# EasyEDA schematic ESP8266 Blind Board V2.json
TITLE: Sheet_1; REV: 1.0; Date: 2019-06-16; Sheet: 1/1; Drawn By: m4ha7m4; Company: Your Company
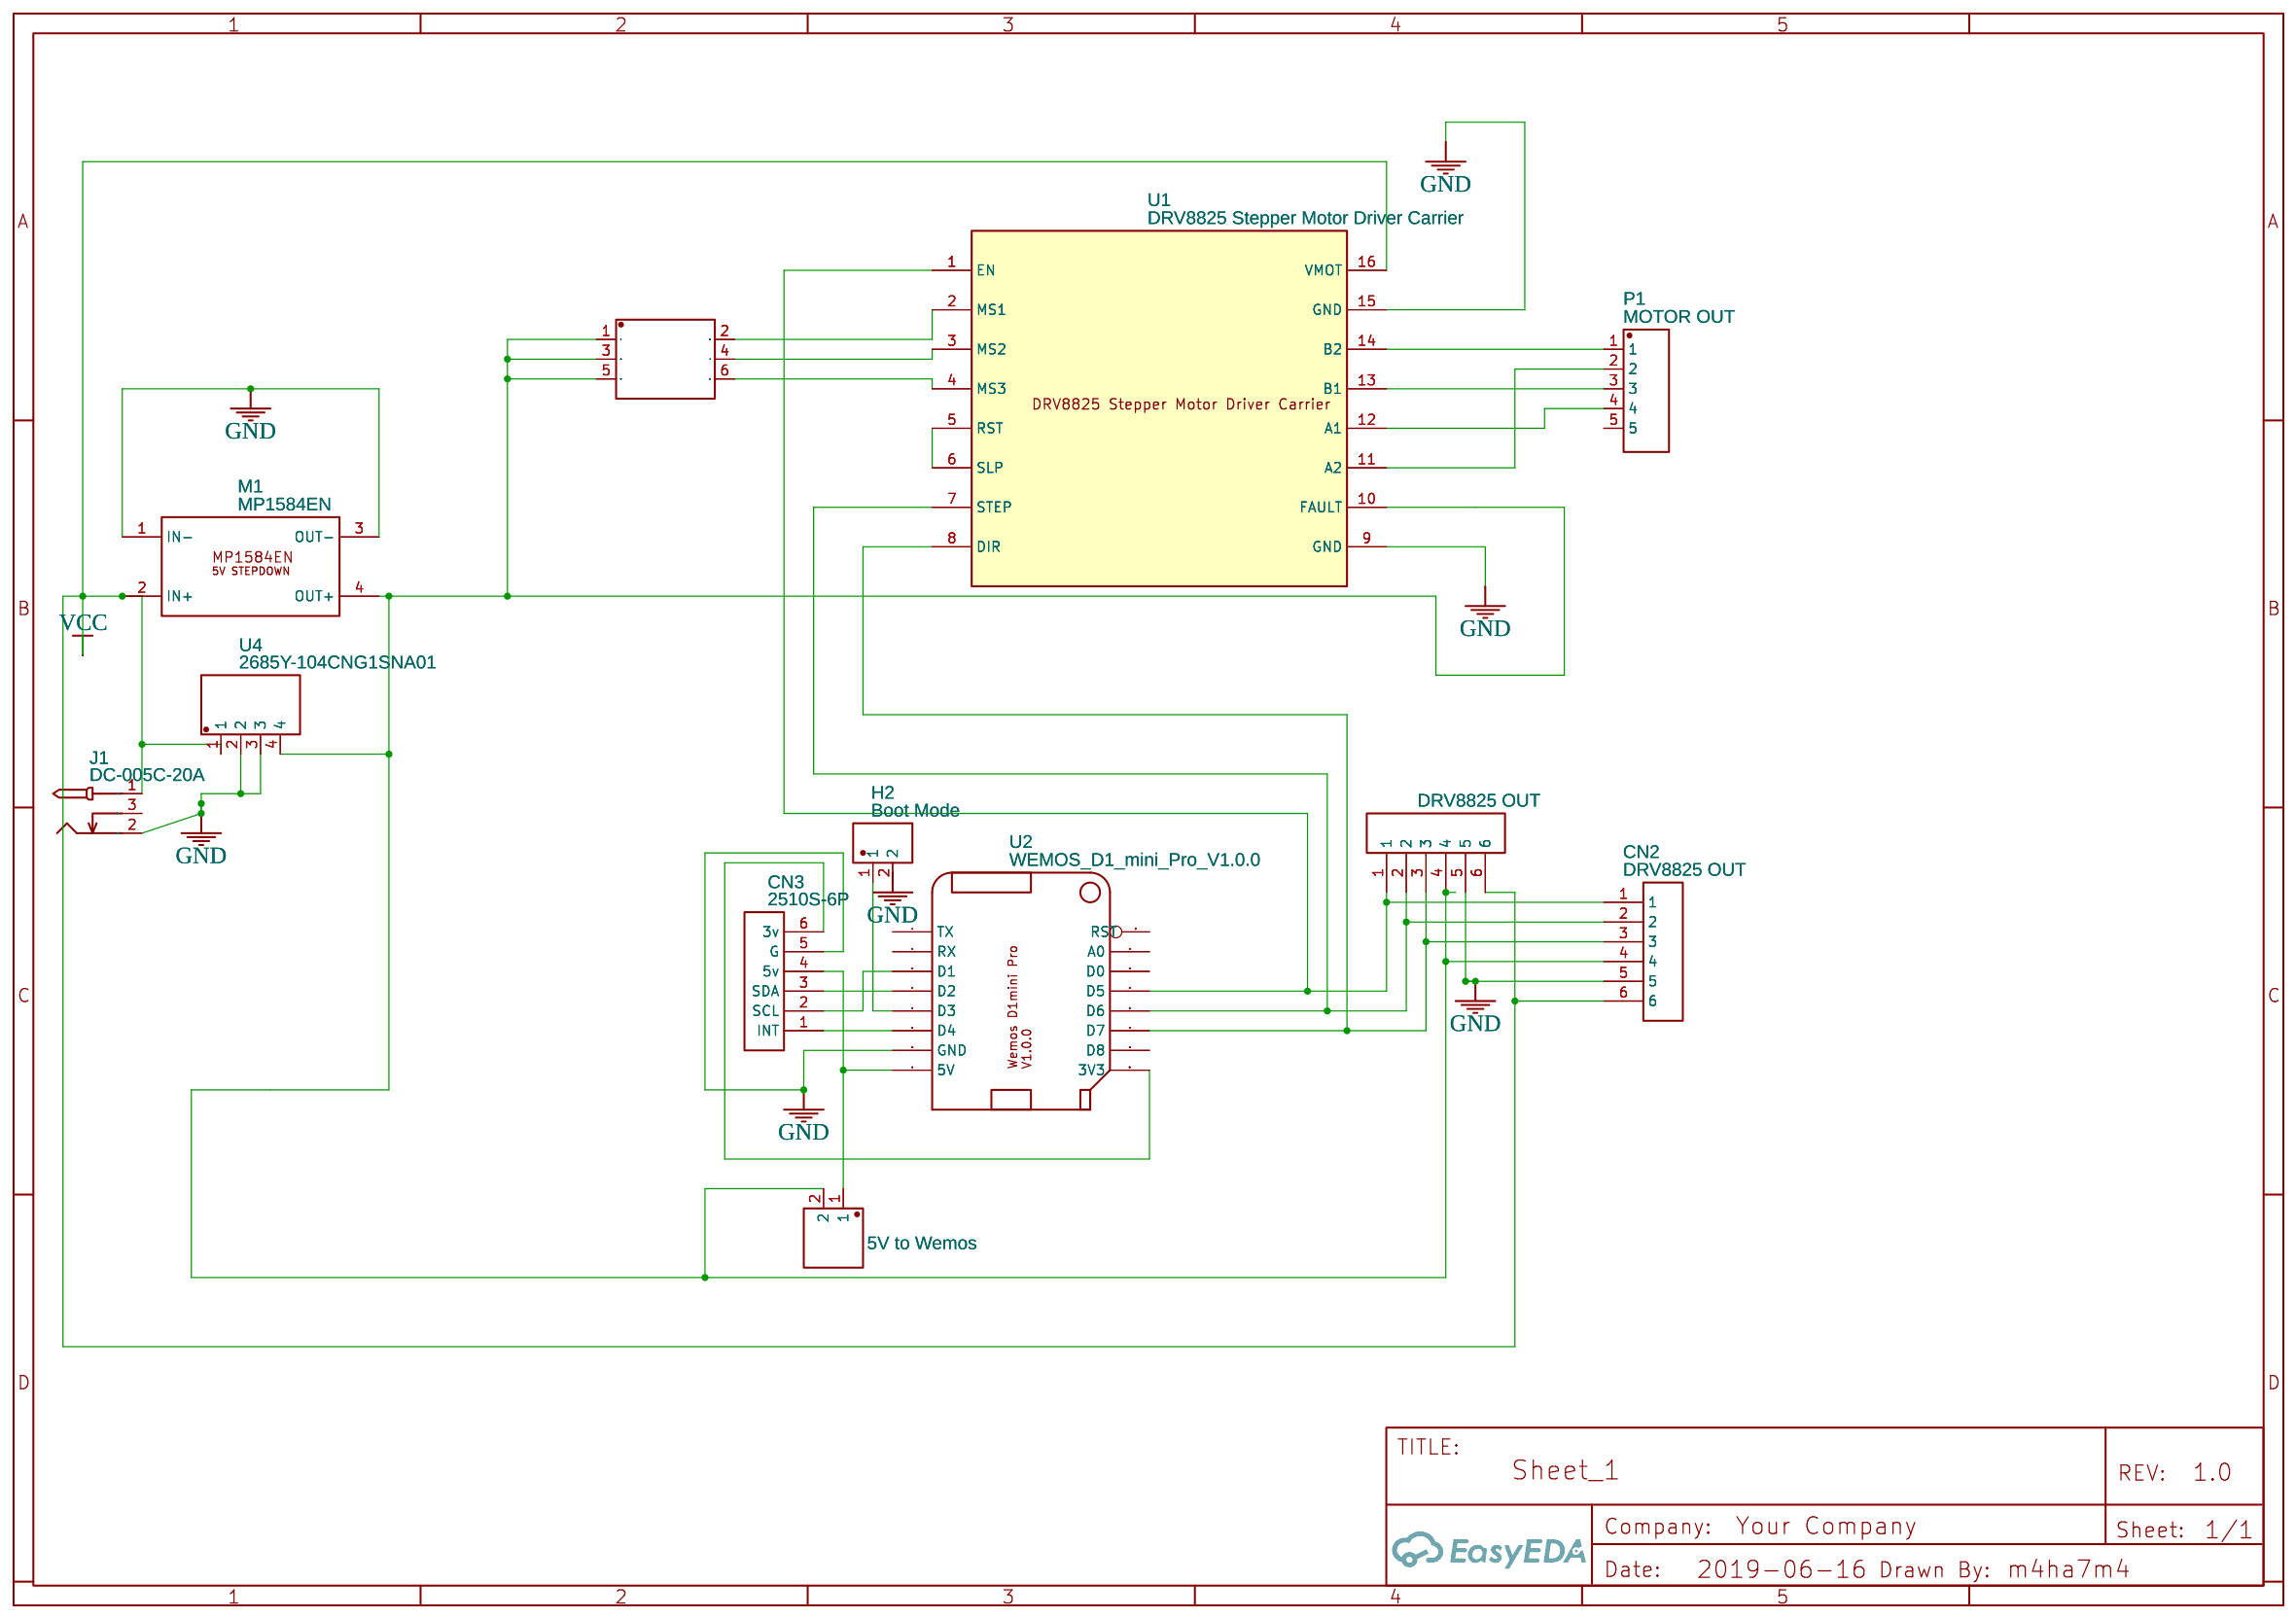
[diagram p0: schematic sheet]

## Parts
CN1  DRV8825 OUT  [SIP-2.54MM-6P-BOOMELE-H11.5]
CN2  DRV8825 OUT  [SIP-2.54MM-6P-BOOMELE-H11.5]
CN3  2510S-6P  [SIP-2.54MM-6P-BOOMELE-H11.5]
H1  5V to Wemos  [210S-1X2P]
H2  Boot Mode  [HDR-2X1/2.54]
J1  DC-005C-20A  [CON-TH_3PIN_DC-005C-20A]
M1  MP1584EN  [MP1584EN-5V]
P1  MOTOR OUT  [KF2510-5A]
U1  DRV8825 Stepper Motor Driver Carrier  [DRV8825 STEPPER MOTOR DRIVER CARRIER]
U2  WEMOS_D1_mini_Pro_V1.0.0  [WEMOS_D1_MINI_PRO_V1.0.0]
U4  2685Y-104CNG1SNA01  [2685Y-104CNG1SNA01]
U5  MS 1 2 3  [SDIP-S-3X2_2.54]

## Library data of the parts
CN1 CN2 = -: Supplier: LCSC; Supplier Part: C140771; Manufacturer: Shenzhen Cankemeng; Manufacturer Part: 2510S-6P; Contributor: LCSC
CN3 = -: Supplier: LCSC; Supplier Part: C140771; Manufacturer: Shenzhen Cankemeng; Contributor: LCSC
H1 = -: Supplier: LCSC; Manufacturer: Ckmtw; Manufacturer Part: 210S-1*2P L=11.6MMGold-plated black; Contributor: LCSC; Supplier Part: C124375
H2 = -: Supplier: LCSC; Manufacturer: ZHENGLING; Manufacturer Part: Z-211-0211-0021-001; Contributor: LCSC; Supplier Part: C152154
J1 = -: Supplier: LCSC; Manufacturer: HRO; Supplier Part: C84007
M1 = -: Contributor: raychelm
P1 = -: Supplier: LCSC; Manufacturer: BOOMELE; image: //image.lceda.cn/szlcsc/C27544.jpg; Supplier Part: C27544
U1 = -: Contributor: winter2015; sourceId: YsmgyP7pj; Manufacturer Part: ?
U2 = -: Manufacturer Part: WeMos D1 Mini Pro; Supplier Part: undefined; Contributor: Víctor Iborra
U4 = -: Supplier: LCSC; Supplier Part: C350310; Manufacturer: 华宇创; Contributor: LCSC
U5 = -: Supplier: LCSC; Supplier Part: C358692; Manufacturer: MINTRON; Manufacturer Part: MTP125-1203S1; Contributor: LCSC

## Nets
GND: CN1.5 CN2.5 CN3.5(G) H2.2 J1.2 M1.1(IN-) M1.3(OUT-) U1.9(GND) U1.15(GND) U2.GND U4.2 U4.3
VCC: CN1.6 CN2.6 J1.1 M1.2(IN+) U1.16(VMOT) U4.1
Net-(CN1-1): CN1.1 CN2.1 U1.1(EN) U2.D5
Net-(CN1-2): CN1.2 CN2.2 U1.7(STEP) U2.D6
Net-(CN1-3): CN1.3 CN2.3 U1.8(DIR) U2.D7
Net-(CN1-4): CN1.4 CN2.4 H1.2 M1.4(OUT+) U1.10(FAULT) U4.4 U5.1 U5.3 U5.5
Net-(CN3-1): CN3.1(INT) U2.D4
Net-(CN3-2): CN3.2(SCL) U2.D1
Net-(CN3-3): CN3.3(SDA) U2.D2
Net-(CN3-4): CN3.4(5v) H1.1 U2.5V
Net-(CN3-6): CN3.6(3v) U2.3V3
Net-(H2-1): H2.1 U2.D3
Net-(P1-1): P1.1 U1.14(B2)
Net-(P1-2): P1.2 U1.11(A2)
Net-(P1-3): P1.3 U1.13(B1)
Net-(P1-4): P1.4 U1.12(A1)
Net-(U1-2): U1.2(MS1) U5.2
Net-(U1-3): U1.3(MS2) U5.4
Net-(U1-4): U1.4(MS3) U5.6
Net-(U1-5): U1.5(RST) U1.6(SLP)

Not connected (* = marked no-connect by the designer): J1 3; P1 5; U2 A0 D0 D8 RST RX TX
